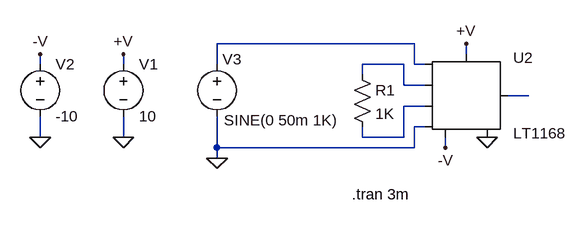
[diagram p0: schematic 1168.asc]
1168.asc, the LTspice schematic file:
Version 4
SHEET 1 936 680
WIRE 352 144 48 144
WIRE 432 160 432 144
WIRE -224 176 -224 160
WIRE -96 176 -96 160
WIRE 48 176 48 144
WIRE 336 176 272 176
WIRE 352 176 352 144
WIRE 368 176 352 176
WIRE 272 192 272 176
WIRE 336 208 336 176
WIRE 368 208 336 208
WIRE 528 224 496 224
WIRE 368 240 336 240
WIRE 368 272 352 272
WIRE -224 288 -224 256
WIRE -96 288 -96 256
WIRE 272 288 272 272
WIRE 336 288 336 240
WIRE 336 288 272 288
WIRE 48 304 48 256
WIRE 352 304 352 272
WIRE 352 304 48 304
WIRE 400 304 400 288
WIRE 48 320 48 304
FLAG -96 288 0
FLAG -96 160 +V
FLAG -224 288 0
FLAG -224 160 -V
FLAG 432 144 +V
FLAG 400 304 -V
FLAG 48 320 0
FLAG 464 288 0
SYMBOL voltage -96 160 R0
SYMATTR InstName V1
SYMATTR Value 10
SYMBOL voltage -224 160 R0
SYMATTR InstName V2
SYMATTR Value -10
SYMBOL res 256 176 R0
SYMATTR InstName R1
SYMATTR Value 1K
SYMBOL voltage 48 160 R0
WINDOW 0 9 8 Left 0
WINDOW 3 11 102 Left 0
SYMATTR InstName V3
SYMATTR Value SINE(0 50m 1K)
SYMBOL opamps\\LT1168 432 224 R0
SYMATTR InstName U2
TEXT 256 376 Left 0 !.tran 3m

The netlist it stands for:
* 1168.asc
V1 +V 0 10
V2 -V 0 -10
R1 N002 N004 1K
V3 N001 0 SINE(0 50m 1K)
XU2 N002 0 N001 -V 0 N003 +V N004 LT1168
.tran 3m
.lib LTC.lib
.backanno
.end